# Altium project NANOPSU.PrjPcb
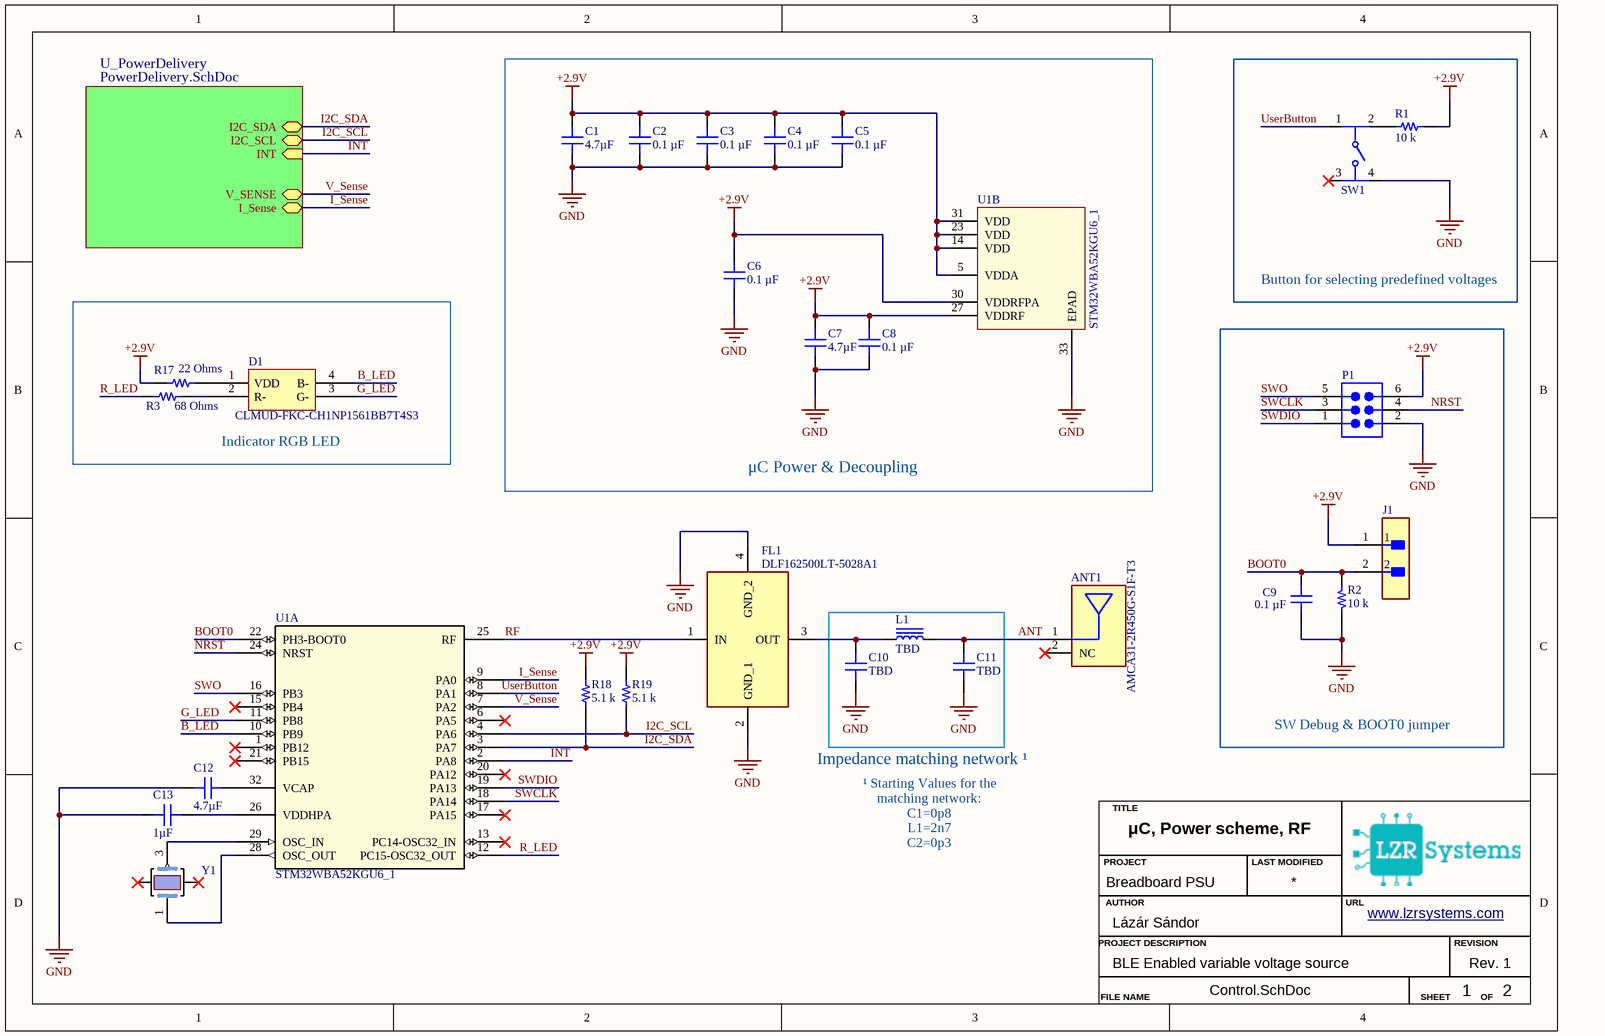
[diagram p0: Control.SchDoc]
G.Author: Lázár Sándor; G.Description: BLE Enabled variable voltage source; G.Project: Breadboard PSU; G.Revision: Rev. 1; G.Title: μC with Power Delivery; G.URL: www.lzrsystems.com
2 sheets, 60 parts. Net scope: hierarchical (ports join the sheet entries above them; power ports are global).
Board file: PCB1.PcbDoc
Sheets:
  Control.SchDoc
    U_PowerDelivery = PowerDelivery.SchDoc

## Sheet Control.SchDoc: μC, Power scheme, RF
size A4; SheetNumber: 1; SheetTotal: 2

### Parts
ANT1  AMCA31-2R450G-S1F-T3  [FP-AMCA31-MFG]
C1  4.7µF  [CAP 0805_2012]
C2  0.1 µF  [CAP 0805_2012]
C3  0.1 µF  [CAP 0805_2012]
C4  0.1 µF  [CAP 0805_2012]
C5  0.1 µF  [CAP 0805_2012]
C6  0.1 µF  [CAP 0805_2012]
C7  4.7µF  [CAP 0805_2012]
C8  0.1 µF  [CAP 0805_2012]
C9  0.1 µF  [CAP 0805_2012]
C10  Capacitance: TBD  [CAP 0402_1005]  (hidden comment: 3.6 pF)
C11  Capacitance: TBD  [CAP 0402_1005]  (hidden comment: 3.6 pF)
C12  4.7µF  [CAP 0805_2012]
C13  1µF  [CAP 0805_2012]
D1  CLMUD-FKC-CH1NP1561BB7T4S3  [SON70P150X100-4N]
FL1  DLF162500LT-5028A1  [DLF162500LT5028A1]
J1  TSW-102-12-T-S  [FP-TSW-102-12-T-S-MFG]  (value not drawn)
L1  TBD  [IND 0402_1005]
P1  MTLW-103-06-G-D-180  [SMTC-MTLW-103-06-X-D-180]  (value not drawn)
R1  10 k  [RES 0805_2012]
R2  10 k  [RES 0805_2012]
R3  68 Ohms  [YAGEO RES 0805_2012]
R17  22 Ohms  [RES 0805_2012]
R18  5.1 k  [YAGEO RES 0805_2012]
R19  5.1 k  [YAGEO RES 0805_2012]
SW1  TL1105AF160Q  [FP-TL1105AF160Q-MFG]  (value not drawn)
U1  STM32WBA52KGU6_1  [UFQFPN-32_STM]  (parts A,B of 2)
Y1  XRCGB32M000F2P01R0  [XRCGB]  (value not drawn)

### Blocks framed on the sheet
μC Power & Decoupling: C1-C8 U1
Button for selecting predefined voltages: R1 SW1
Indicator RGB LED: D1 R3 R17
SW Debug & BOOT0 jumper: C9 J1 P1 R2

### Sub-sheets
U_PowerDelivery = PowerDelivery.SchDoc: I2C_SDA (bidir), I2C_SCL (bidir), INT (in), I_Sense (bidir), V_SENSE (bidir)

### Nets
+2.9V: C1.2 C2.2 C3.2 C4.2 C5.2 C6.2 C7.2 C8.2 J1.1 P1.6 R1.2 R17.2 R18.2 R19.2 U1.5(VDDA) U1.14(VDD) U1.23(VDD) U1.27(VDDRF) U1.30(VDDRFPA) U1.31(VDD)
GND: C1.1 C2.1 C3.1 C4.1 C5.1 C6.1 C7.1 C8.1 C9.1 C10.1 C11.1 C12.1 C13.2 FL1.2(GND_1) FL1.4(GND_2) P1.2 R2.1 SW1.4 U1.33(EPAD)
ANT: ANT1.1(Feed_Point) C11.2 L1.2
B_LED: D1.4(B-) U1.10(PB9)
BOOT0: C9.2 J1.2 R2.2 U1.22(PH3-BOOT0)
G_LED: D1.3(G-) U1.11(PB8)
I2C_SCL: R19.1 U1.4(PA6) ; sheet U_PowerDelivery/I2C_SCL
I2C_SDA: R18.1 U1.3(PA7) ; sheet U_PowerDelivery/I2C_SDA
I_Sense: U1.9(PA0) ; sheet U_PowerDelivery/I_Sense
INT: U1.2(PA8) ; sheet U_PowerDelivery/INT
NRST: P1.4 U1.24(NRST)
R_LED: R3.1 U1.12(PC15-OSC32_OUT)
RF: FL1.1(IN) U1.25(RF)
SWCLK: P1.3 U1.18(PA14)
SWDIO: P1.1 U1.19(PA13)
SWO: P1.5 U1.16(PB3)
UserButton: SW1.1 U1.8(PA1)
V_Sense: U1.7(PA2) ; sheet U_PowerDelivery/V_SENSE
NetC10_2: C10.2 FL1.3(OUT) L1.1
NetC12_2: C12.2 U1.32(VCAP)
NetC13_1: C13.1 U1.26(VDDHPA)
NetD1_1: D1.1(VDD) R17.1
NetD1_2: D1.2(R-) R3.2
NetR1_1: R1.1 SW1.2
NetU1_28: U1.28(OSC_OUT) Y1.1(XTAL_1)
NetU1_29: U1.29(OSC_IN) Y1.3(XTAL_2)

Not connected (* = marked no-connect by the designer): ANT1 2(NC)*; SW1 3*; U1 1(PB12)* 6(PA5)* 13(PC14-OSC32_IN)* 15(PB4)* 17(PA15)* 20(PA12)* 21(PB15)*; Y1 2(NC_1)* 4*

### Notes on the sheet
- Impedance matching network ¹
- ¹ Starting Values for the matching network:
  C1=0p8
  L1=2n7
  C2=0p3
- TITLE
- AUTHOR
- PROJECT
- LAST MODIFIED
- URL
- PROJECT DESCRIPTION
- REVISION
- FILE NAME
- SHEET
- OF

### Library data of the parts
ANT1 = CMP-00025-00003-1: Chip Dielectric Antenna; 1dBi; 2450MHz; T/R; Frequency: 2.45GHz; Mounting Technology: Surface Mount; Max Operating Temperature: 85°C; Min Operating Temperature: -40°C; Case/Package: SMD/SMT
C1 C7 C12 = 0805ZD475KAT2A: CAP CER 4.7UF 10V X5R 0805; manufacturer: AVX Corporation; Tolerance: ±10%; Part Number: 0805ZD475KAT2A; Capacitance: 4.7µF; Applications: General Purpose; componentlink1description: Datasheet; componentlink1url: http://datasheets.avx.com/cx5r.pdf; componentlink2description: DigiKey Link; componentlink2url: http://digikey.com/product-detail/en/avx-corporation/0805ZD475KAT2A/478-1415-1-ND/564447; Device Package: 0805 (2012 Metric); lastupdated: 9/2/2020 1:04:40 AM; Lifecycle Status: Active; Minimum Order: 1; Mounting Type: Surface Mount, MLCC; Operating Temperature: -55°C ~ 85°C; Package / Case: 0805 (2012 Metric); packaging: TapeAndReel; partid: 3139; Part Status: Active; price: 0.12; series: -; Size / Dimension: 0.079" L x 0.049" W (2.01mm x 1.25mm); Supplier 1: DigiKey; Supplier Part Number 1: 478-1415-1-ND; Temperature Coefficient: X5R; Thickness (Max): 0.055" (1.40mm); value: 4.7µF; Voltage - Rated: 10V
C2-C6 C8 C9 = KGM21NR71H104MT: CAP CER 0.1UF 50V X7R 0805; manufacturer: KYOCERA AVX; Tolerance: ±20%; Part Number: KGM21NR71H104MT; Capacitance: 0.1 µF; Applications: General Purpose; componentlink1description: Datasheet; componentlink1url: https://datasheets.kyocera-avx.com/X7RDielectric.pdf; componentlink2description: DigiKey Link; componentlink2url: https://www.digikey.com/en/products/detail/kyocera-avx/KGM21NR71H104MT/929983; Device Package: 0805 (2012 Metric); lastupdated: 2/9/2024 8:14:06 PM; Lifecycle Status: Active; Minimum Order: 1; Mounting Type: Surface Mount, MLCC; Operating Temperature: -55°C ~ 125°C; Package / Case: 0805 (2012 Metric); packaging: TapeAndReel; partid: 53901; Part Status: Active; price: 0.01; series: KGM - X7R; Size / Dimension: 0.079" L x 0.049" W (2.01mm x 1.25mm); Supplier 1: DigiKey; Supplier Part Number 1: 478-KGM21NR71H104MTCT-ND; Temperature Coefficient: X7R; Thickness (Max): 0.039" (1.00mm); value: 0.1 µF; Voltage - Rated: 50V
C10 C11 = 600L3R6AT200T: CAP CER 3.6PF 200V C0G/NP0 0402; manufacturer: American Technical Ceramics; Temperature Coefficient: C0G, NP0; Tolerance: ±0.05pF; Part Number: 600L3R6AT200T; Applications: RF, Microwave, High Frequency, Bypass, Decoupling; componentlink1description: Datasheet; componentlink1url: http://www.atceramics.com/UserFiles/600l.pdf; componentlink2description: DigiKey Link; componentlink2url: https://www.digikey.com/en/products/detail/american-technical-ceramics/600L3R6AT200T/3905167; Device Package: 0402 (1005 Metric); Features: High Q, Low Loss, Ultra Low ESR; lastupdated: 2/9/2024 8:04:37 PM; Lifecycle Status: Active; Minimum Order: 1; Mounting Type: Surface Mount, MLCC; Operating Temperature: -55°C ~ 125°C; Package / Case: 0402 (1005 Metric); packaging: TapeAndReel; partid: 2064; Part Status: Active; price: 0.49; series: ATC 600L; Size / Dimension: 0.040" L x 0.020" W (1.02mm x 0.51mm); Supplier 1: DigiKey; Supplier Part Number 1: 1284-1126-1-ND; Thickness (Max): 0.024" (0.60mm); value: 3.6 pF; Voltage - Rated: 200V
C13 = 08053C105KAT2A: CAP CER 1UF 25V X7R 0805; manufacturer: AVX Corporation; Tolerance: ±10%; Part Number: 08053C105KAT2A; Capacitance: 1µF; Applications: General Purpose; componentlink1description: Datasheet; componentlink1url: http://datasheets.avx.com/X7RDielectric.pdf; componentlink2description: DigiKey Link; componentlink2url: http://digikey.com/product-detail/en/avx-corporation/08053C105KAT2A/478-5030-1-ND/1888241; Device Package: 0805 (2012 Metric); lastupdated: 9/2/2020 1:04:33 AM; Lifecycle Status: Active; Minimum Order: 1; Mounting Type: Surface Mount, MLCC; Operating Temperature: -55°C ~ 125°C; Package / Case: 0805 (2012 Metric); packaging: TapeAndReel; partid: 7289; Part Status: Active; price: 0.04; series: -; Size / Dimension: 0.079" L x 0.049" W (2.01mm x 1.25mm); Supplier 1: DigiKey; Supplier Part Number 1: 478-5030-1-ND; Temperature Coefficient: X7R; Thickness (Max): 0.037" (0.94mm); value: 1µF; Voltage - Rated: 25V
D1 = CMP-007-00044-3: Cree LED RGB LED Common Annode If=10mA Vf = 1.9/2.6/2.7
FL1 = DLF162500LT-5028A1: Filter; Manufacturer_Name: TDK; Datasheet Link: https://product.tdk.com/system/files/dam/doc/product/rf/rf/filter/catalog/rf_lpf_dlf162500lt-5028a1_en.pdf; Height: 0.4mm; Manufacturer_Part_Number: DLF162500LT-5028A1; Mouser Part Number: 810-DLF16250LT5028A1; Mouser Price/Stock: https://www.mouser.co.uk/ProductDetail/TDK/DLF162500LT-5028A1?qs=U%2FZX79kHR%2FlwIbAISCs3qA%3D%3D; Arrow Part Number: DLF162500LT-5028A1; Arrow Price/Stock: https://www.arrow.com/en/products/dlf162500lt-5028a1/tdk?utm_currency=USD&region=nac
J1 = CMP-002-00077-1: Pin Header, Board-to-Board, 2.54 mm, 1 Rows, 2 Contacts, Through Hole, TSW Series; Voltage Rating: 550V; Gender: Male; Min Operating Temperature: -55°C; Max Operating Temperature: 105°C; Mounting Technology: Through Hole
L1 = LQG15HS3N9C02D: FIXED IND 3.9NH 750MA 140MOHM SM; Manufacturer: Murata Electronics; DC Resistance (DCR): 140mOhm Max; Frequency - Self Resonant: 6GHz; Inductance Frequency - Test: 100 MHz; Material - Core: Air; Shielding: Unshielded; Tolerance: ±0.2nH; Type: Multilayer; Part Number: LQG15HS3N9C02D; ComponentLink1Description: Datasheet; ComponentLink1URL: https://search.murata.co.jp/Ceramy/image/img/P02/JELF243B-0010.pdf; ComponentLink2Description: DigiKey Link; ComponentLink2URL: https://www.digikey.com/en/products/detail/murata-electronics/LQG15HS3N9C02D/6798548; Current Rating (Amps): 750 mA; Device Package: 0402 (1005 Metric); Height - Seated (Max): 0.022" (0.55mm); Inductance: 3.9 nH; LastUpdated: 6/3/2024 8:13:02 PM; Lifecycle Status: Active; Minimum Order: 1; Mounting Type: Surface Mount; Operating Temperature: -55°C ~ 125°C; Package / Case: 0402 (1005 Metric); Packaging: TapeAndReel; PartId: 2221; Part Status: Active; Price: 0.02; Series: LQG15; Size / Dimension: 0.039" L x 0.020" W (1.00mm x 0.50mm); Supplier 1: DigiKey; Supplier Part Number 1: 490-15123-1-ND; Supplier Device Package: 0402 (1005 Metric); Value: 3.9 nH
P1 = CMP-002-00079-1: Pin Header, Board-to-Board, 2.54 mm, 2 Rows, 6 Contacts, Through Hole, MTLW Series; Max Operating Temperature: 125°C; Min Operating Temperature: -55°C
R1 R2 = RNCS0805BKE10K0: RES 10K OHM 0.1% 1/10W 0805; Manufacturer: Stackpole Electronics Inc; Power (Watts): 0.1W, 1/10W; Resistance: 10 kOhms; Temperature Coefficient: ±25ppm/°C; Part Number: RNCS0805BKE10K0; Value: 10 k; ComponentLink1Description: Datasheet; ComponentLink1URL: https://www.seielect.com/catalog/sei-rncs_rnch.pdf; ComponentLink2Description: DigiKey Link; ComponentLink2URL: https://www.digikey.com/en/products/detail/stackpole-electronics-inc/RNCS0805BKE10K0/1800067; Composition: Thin Film; Device Package: 0805 (2012 Metric); Features: Anti-Corrosive, Automotive AEC-Q200, Moisture Resistant; Height - Seated (Max): 0.026" (0.65mm); LastUpdated: 2/8/2024 9:02:39 PM; Lifecycle Status: Active; Minimum Order: 1; Number of Terminations: 2; Operating Temperature: -55°C ~ 155°C; Package / Case: 0805 (2012 Metric); Packaging: TapeAndReel; PartId: 27713; Part Status: Active; Price: 0.07; Ratings: AEC-Q200; Series: RNCS; Size / Dimension: 0.079" L x 0.049" W (2.00mm x 1.25mm); Supplier 1: DigiKey; Supplier Part Number 1: RNCS0805BKE10K0CT-ND; Supplier Device Package: 0805; Tolerance: ±0.1%
R3 = RC0805FR-0768R1L: RES 68.1 OHM 1% 1/8W 0805; Manufacturer: Yageo; Power (Watts): 0.125W, 1/8W; Resistance: 68.1 Ohms; Temperature Coefficient: ±100ppm/°C; Part Number: RC0805FR-0768R1L; Value: 68 Ohms; ComponentLink1Description: Datasheet; ComponentLink1URL: https://www.yageo.com/upload/media/product/productsearch/datasheet/rchip/PYu-RC_Group_51_RoHS_L_10.pdf; ComponentLink2Description: DigiKey Link; ComponentLink2URL: https://www.digikey.com/en/products/detail/yageo/RC0805FR-0768R1L/728099; Composition: Thick Film; Device Package: 0805 (2012 Metric); Features: Moisture Resistant; Height - Seated (Max): 0.024" (0.60mm); LastUpdated: 7/25/2024 9:20:18 AM; Lifecycle Status: Active; Minimum Order: 1; Number of Terminations: 2; Operating Temperature: -55°C ~ 155°C; Package / Case: 0805 (2012 Metric); Packaging: TapeAndReel; PartId: 44821; Part Status: Active; Price: 0.01; Series: RC_L; Size / Dimension: 0.079" L x 0.049" W (2.00mm x 1.25mm); Supplier 1: DigiKey; Supplier Part Number 1: 311-68.1CRCT-ND; Supplier Device Package: 0805; Tolerance: ±1%
R17 = SFR10EZPJ220: RES 22 OHM 5% 1/8W 0805; Manufacturer: Rohm Semiconductor; Power (Watts): 0.125W, 1/8W; Temperature Coefficient: ±200ppm/°C; Part Number: SFR10EZPJ220; Value: 22 Ohms; ComponentLink1Description: Datasheet; ComponentLink1URL: https://fscdn.rohm.com/en/products/databook/datasheet/passive/resistor/chip_resistor/sfr-e.pdf; ComponentLink2Description: DigiKey Link; ComponentLink2URL: https://www.digikey.com/en/products/detail/rohm-semiconductor/SFR10EZPJ220/17944490; Composition: Thick Film; Device Package: 0805 (2012 Metric); Features: Anti-Sulfur, Automotive AEC-Q200; Height - Seated (Max): 0.026" (0.65mm); LastUpdated: 2/8/2024 9:00:13 PM; Lifecycle Status: Active; Minimum Order: 1; Number of Terminations: 2; Operating Temperature: -55°C ~ 155°C; Package / Case: 0805 (2012 Metric); Packaging: TapeAndReel; PartId: 73570; Part Status: Active; Price: 0.01; Ratings: AEC-Q200; Resistance: 22 Ohms; Series: SFR; Size / Dimension: 0.079" L x 0.049" W (2.00mm x 1.25mm); Supplier 1: DigiKey; Supplier Part Number 1: 511-SFR10EZPJ220CT-ND; Supplier Device Package: 0805; Tolerance: ±5%
R18 R19 = RT0805BRD075K1L: RES SMD 5.1K OHM 0.1% 1/8W 0805; Manufacturer: Yageo; Power (Watts): 0.125W, 1/8W; Resistance: 5.1 kOhms; Temperature Coefficient: ±25ppm/°C; Part Number: RT0805BRD075K1L; Value: 5.1 k; ComponentLink1Description: Datasheet; ComponentLink1URL: https://www.yageo.com/upload/media/product/productsearch/datasheet/rchip/PYu-RT_1-to-0.01_RoHS_L_11.pdf; ComponentLink2Description: DigiKey Link; ComponentLink2URL: https://www.digikey.com/en/products/detail/yageo/RT0805BRD075K1L/1075977; Composition: Thin Film; Device Package: 0805 (2012 Metric); Height - Seated (Max): 0.024" (0.60mm); LastUpdated: 7/25/2024 9:20:25 AM; Lifecycle Status: Active; Minimum Order: 1; Number of Terminations: 2; Operating Temperature: -55°C ~ 155°C; Package / Case: 0805 (2012 Metric); Packaging: TapeAndReel; PartId: 32968; Part Status: Active; Price: 0.04; Series: RT; Size / Dimension: 0.079" L x 0.049" W (2.00mm x 1.25mm); Supplier 1: DigiKey; Supplier Part Number 1: YAG1938CT-ND; Supplier Device Package: 0805; Tolerance: ±0.1%
SW1 = CMP-011-00014-1: Switch Tactile N.O. SPST Round Button PC Pins 0.05A 50VDC 1.57N Thru-Hole; Current Rating: 50mA; Throw Configuration: SPST; Mounting Technology: Through Hole; Min Operating Temperature: -20°C; Max Current Rating: 50mA; Max Operating Temperature: 70°C
U1 = CMP-031-00007-6: Ultra-low-power, Arm Cortex-M33 Trust Zone MCU 100 MHz with 1 Mbyte of Flash memory,  Bluetooth LE 5.4; Manufacturer_Name: STMicroelectronics; Type: Type; Source: STM32WBA52KGU6.SchLib; Design Item ID: STM32WBA52KGU6_1; Manufacturer_Part_Number: STM32WBA52KGU6; Datasheet: https://www.st.com/resource/en/datasheet/stm32wba52ce.pdf; RefDes: RefDes; Copyright: Copyright (C) 2025 Ultra Librarian. All rights reserved.; Component Type: Standard; Pins: 33
Y1 = XRCGB32M000F2P01R0: Crystal or Oscillator; Manufacturer_Name: Murata Electronics; Datasheet Link: https://www.murata.com/products/productdata/8801065500702/SPEC-XRCGB32M000F2P01R0.pdf; Height: 0.7mm; Manufacturer_Part_Number: XRCGB32M000F2P01R0; Mouser Part Number: 81-XRCGB32M000F2P01R; Mouser Price/Stock: https://www.mouser.co.uk/ProductDetail/Murata-Electronics/XRCGB32M000F2P01R0?qs=rrS6PyfT74czmgr%252Bqfmsyw%3D%3D; Arrow Part Number: XRCGB32M000F2P01R0; Arrow Price/Stock: https://www.arrow.com/en/products/xrcgb32m000f2p01r0/murata-manufacturing?region=nac

## Sheet PowerDelivery.SchDoc: PPS, 2.9V rail, U/I sensing
size A4; SheetNumber: 2; SheetTotal: 2
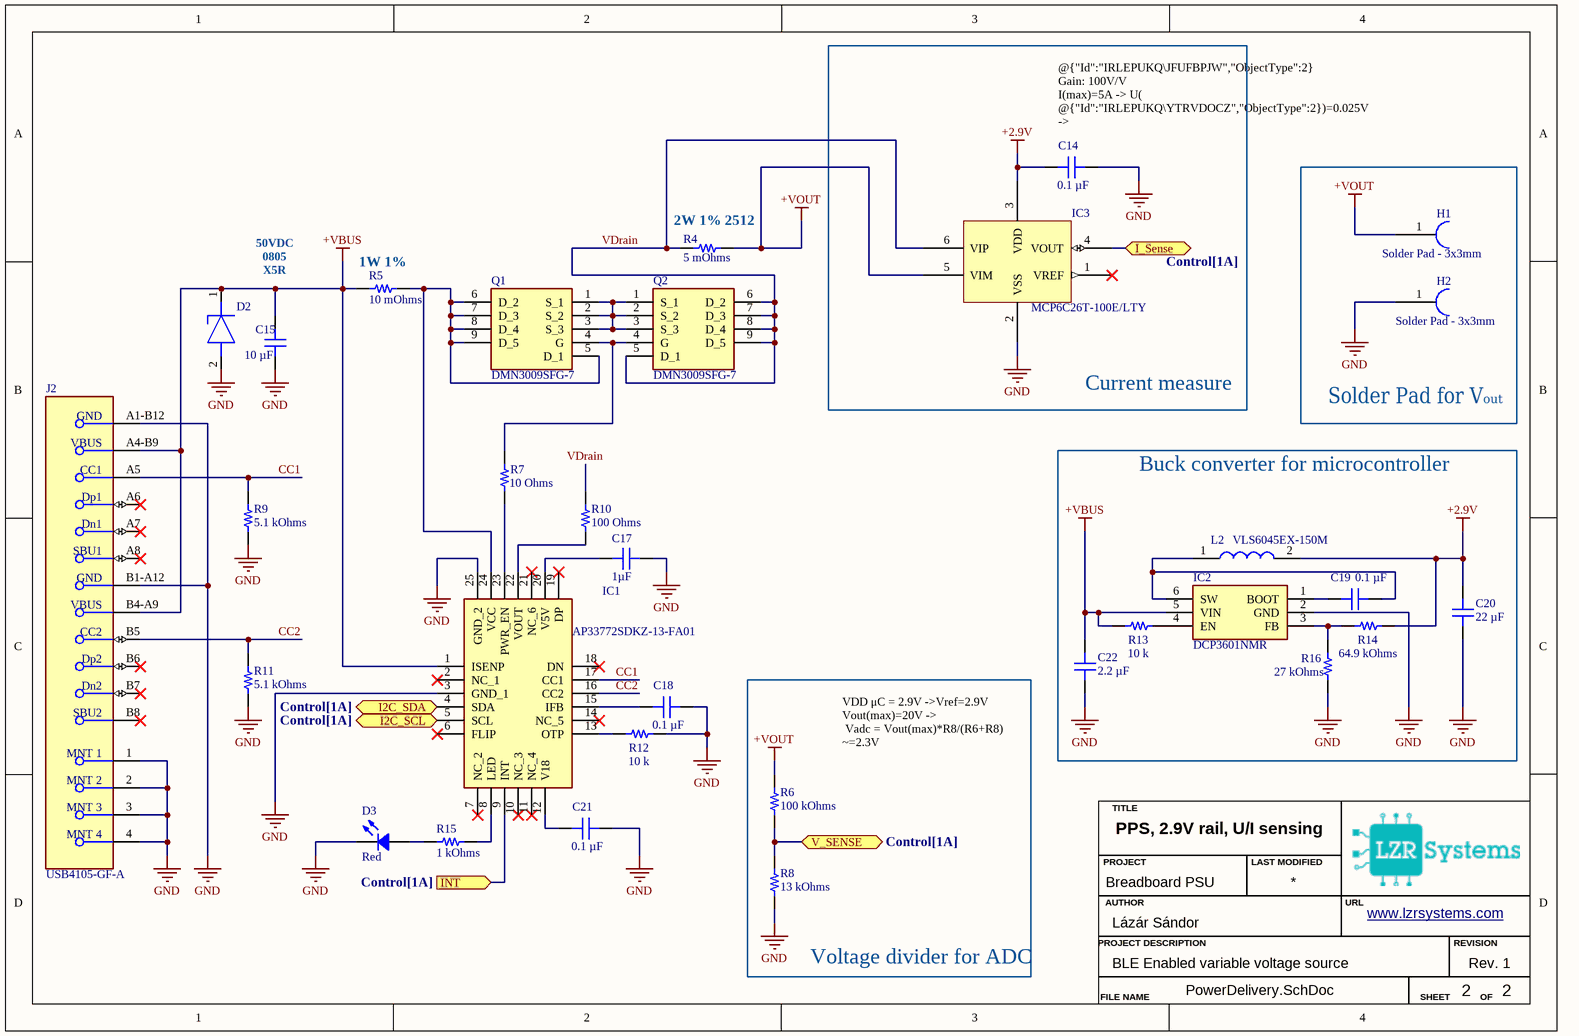
[diagram p1: PowerDelivery.SchDoc]

### Parts
C14  0.1 µF  [CAP 0805_2012]
C15  10 µF  [MURATA GRM21B 0805_2012]
C17  1µF  [CAP 0805_2012]
C18  0.1 µF  [CAP 0805_2012]
C19  0.1 µF  [CAP 0805_2012]
C20  22 µF  [CAP 1206_3216 - 0.8MM]
C21  0.1 µF  [CAP 0805_2012]
C22  2.2 µF  [CAP 1206_3216 - 0.8MM]
D2  PESD24VS1UA,115  [SOD2512X110N]  (value not drawn)
D3  Red  [LED 1206_3216 RED]
H1  Solder Pad - 3x3mm  [Solder Pad - 3x3mm-Footprint-1]
H2  Solder Pad - 3x3mm  [Solder Pad - 3x3mm-Footprint-1]
IC1  AP33772SDKZ-13-FA01  [AP33772SDKZ13FA01]
IC2  DCP3601NMR  [SOT95P280X125-6N]
IC3  MCP6C26T-100E/LTY  [SOT65P210X80-6N]
J2  USB4105-GF-A  [FP-USB4105-GF-A-MFG]
L2  VLS6045EX-150M  [VLS6045]
Q1  DMN3009SFG-7  [DMTH8008LFGQ7]
Q2  DMN3009SFG-7  [DMTH8008LFGQ7]
R4  5 mOhms  [STACKPOLE CSM2512]
R5  10 mOhms  [RES 1206_3216]
R6  100 kOhms  [RES 0805_2012]
R7  10 Ohms  [RES 0805_2012]
R8  13 kOhms  [RES 0805_2012]
R9  5.1 kOhms  [YAGEO RES 0805_2012]
R10  100 Ohms  [RES 0805_2012]
R11  5.1 kOhms  [YAGEO RES 0805_2012]
R12  10 k  [RES 0805_2012]
R13  10 k  [RES 0805_2012]
R14  64.9 kOhms  [RES 0805_2012]
R15  1 kOhms  [RES 0805_2012]
R16  27 kOhms  [YAGEO RES 0805_2012]

### Blocks framed on the sheet
Current measure: C14 IC3
Solder Pad for Vₒᵤₜ: H1 H2
Buck converter for microcontroller: C19 C20 C22 IC2 L2 R13 R14 R16
Voltage divider for ADC: R6 R8

### Ports
I2C_SCL (bidir, see Control[1A]), I2C_SDA (bidir, see Control[1A]), I_Sense (bidir, see Control[1A]), INT (in, see Control[1A]), V_SENSE (bidir, see Control[1A])

### Nets
+2.9V: C14.2 C20.2 IC3.3(VDD) L2.2 R14.2
+VBUS: C15.2 C22.2 D2.1(K) IC1.1(ISENP) IC2.5(VIN) J2.A4-B9(VBUS) J2.B4-A9(VBUS) R5.1 R13.1
+VOUT: H1.1 IC3.5(VIM) R4.2 R6.2
GND: C14.1 C15.1 C17.2 C18.1 C20.1 C21.1 C22.1 D2.2(A) D3.2 H2.1 IC1.3(GND_1) IC1.25(GND_2) IC2.2(GND) IC3.2(VSS) J2.1(MNT_1) J2.2(MNT_2) J2.3(MNT_3) J2.4(MNT_4) J2.A1-B12(GND) J2.B1-A12(GND) R8.1 R9.1 R11.1 R12.2 R16.1
CC1: IC1.17(CC1) J2.A5(CC1) R9.2
CC2: IC1.16(CC2) J2.B5(CC2) R11.2
I2C_SCL: IC1.5(SCL) ; port I2C_SCL
I2C_SDA: IC1.4(SDA) ; port I2C_SDA
I_Sense: IC3.4(VOUT) ; port I_Sense
INT: IC1.9(INT) ; port INT
V_Sense: R6.1 R8.2 ; port V_SENSE
VDrain: IC3.6(VIP) Q2.5(D_1) Q2.6(D_2) Q2.7(D_3) Q2.8(D_4) Q2.9(D_5) R4.1 R10.2
NetC17_1: C17.1 IC1.20(V5V)
NetC18_2: C18.2 IC1.15(IFB)
NetC19_1: C19.1 IC2.1(BOOT)
NetC19_2: C19.2 IC2.6(SW) L2.1
NetC21_2: C21.2 IC1.12(V18)
NetD3_1: D3.1 R15.1
NetIC1_8: IC1.8(LED) R15.2
NetIC1_13: IC1.13(OTP) R12.1
NetIC1_22: IC1.22(VOUT) R10.1
NetIC1_23: IC1.23(PWR_EN) R7.1
NetIC1_24: IC1.24(VCC) Q1.5(D_1) Q1.6(D_2) Q1.7(D_3) Q1.8(D_4) Q1.9(D_5) R5.2
NetIC2_3: IC2.3(FB) R14.1 R16.2
NetIC2_4: IC2.4(EN) R13.2
NetQ1_1: Q1.1(S_1) Q1.2(S_2) Q1.3(S_3) Q2.1(S_1) Q2.2(S_2) Q2.3(S_3)
NetQ1_4: Q1.4(G) Q2.4(G) R7.2

Not connected (* = marked no-connect by the designer): IC1 2(NC_1)* 6(FLIP)* 7(NC_2)* 10(NC_3)* 11(NC_4)* 14(NC_5)* 18(DN)* 19(DP)* 21(NC_6)*; IC3 1(VREF)*; J2 A6(Dp1)* A7(Dn1)* A8(SBU1)* B6(Dp2)* B7(Dn2)* B8(SBU2)*

### Notes on the sheet
- (near C14) @{"Id":"IRLEPUKQ\JFUFBPJW","ObjectType":2} Gain: 100V/V
  I(max)=5A -> U( @{"Id":"IRLEPUKQ\YTRVDOCZ","ObjectType":2})=0.025V ->
  Uadc(max) = 2.5V
- Type @ to refer to a designator
- (near R4) 2W 1% 2512
- 50VDC
  0805
  X5R
- (near R5) 1W 1%
- VDD μC = 2.9V ->Vref=2.9V
  Vout(max)=20V ->
  Vadc = Vout(max)*R8/(R6+R8) ~=2.3V
- TITLE
- AUTHOR
- PROJECT
- LAST MODIFIED
- URL
- PROJECT DESCRIPTION
- REVISION
- FILE NAME
- SHEET
- OF

### Library data of the parts
C14 C18 C19 C21 = CC0805MRX7R9BB104: CAP CER 0.1UF 50V X7R 0805; manufacturer: Yageo; Tolerance: ±20%; Part Number: CC0805MRX7R9BB104; Capacitance: 0.1 µF; Applications: General Purpose; componentlink1description: Datasheet; componentlink1url: https://www.yageo.com/upload/media/product/productsearch/datasheet/mlcc/UPY-GPHC_X7R_6.3V-to-50V_18.pdf; componentlink2description: DigiKey Link; componentlink2url: https://www.digikey.com/en/products/detail/yageo/CC0805MRX7R9BB104/5884281; Device Package: 0805 (2012 Metric); lastupdated: 2/9/2024 8:16:09 PM; Lifecycle Status: Active; Minimum Order: 1; Mounting Type: Surface Mount, MLCC; Operating Temperature: -55°C ~ 125°C; Package / Case: 0805 (2012 Metric); packaging: TapeAndReel; partid: 2475; Part Status: Active; price: 0.01; series: CC; Size / Dimension: 0.079" L x 0.049" W (2.00mm x 1.25mm); Supplier 1: DigiKey; Supplier Part Number 1: 311-4351-1-ND; Temperature Coefficient: X7R; Thickness (Max): 0.037" (0.95mm); value: 0.1 µF; Voltage - Rated: 50V
C15 = GRM21BR61H106KE43L: CAP CER 10UF 50V X5R 0805; manufacturer: Murata Electronics; Tolerance: ±10%; Part Number: GRM21BR61H106KE43L; Capacitance: 10 µF; Applications: Mobile Devices Only; componentlink1description: Datasheet; componentlink1url: https://search.murata.co.jp/Ceramy/image/img/A01X/G101/ENG/GRM21BR61H106KE43-01A.pdf; componentlink2description: DigiKey Link; componentlink2url: https://www.digikey.com/en/products/detail/murata-electronics/GRM21BR61H106KE43L/10326316; Device Package: 0805 (2012 Metric); lastupdated: 8/27/2024 9:29:56 AM; Lifecycle Status: Active; Minimum Order: 1; Mounting Type: Surface Mount, MLCC; Operating Temperature: -55°C ~ 85°C; Package / Case: 0805 (2012 Metric); packaging: TapeAndReel; partid: 39284; Part Status: Active; price: 0.05; series: GRM; Size / Dimension: 0.079" L x 0.049" W (2.00mm x 1.25mm); Supplier 1: DigiKey; Supplier Part Number 1: 490-18663-1-ND; Temperature Coefficient: X5R; Thickness (Max): 0.057" (1.45mm); value: 10 µF; Voltage - Rated: 50V
C17 = 08053C105KAT2A: as C13 on sheet Control; Part Number: 08053C105KAT2A; Capacitance: 1µF; Applications: General Purpose; componentlink1description: Datasheet; componentlink1url: http://datasheets.avx.com/X7RDielectric.pdf; componentlink2description: DigiKey Link; componentlink2url: http://digikey.com/product-detail/en/avx-corporation/08053C105KAT2A/478-5030-1-ND/1888241; Device Package: 0805 (2012 Metric); lastupdated: 9/2/2020 1:04:33 AM; Lifecycle Status: Active; Minimum Order: 1; Mounting Type: Surface Mount, MLCC; Operating Temperature: -55°C ~ 125°C; Package / Case: 0805 (2012 Metric); packaging: TapeAndReel; partid: 7289; Part Status: Active; price: 0.04; series: -; Size / Dimension: 0.079" L x 0.049" W (2.01mm x 1.25mm); Supplier 1: DigiKey; Supplier Part Number 1: 478-5030-1-ND; Temperature Coefficient: X7R; Thickness (Max): 0.037" (0.94mm); value: 1µF; Voltage - Rated: 25V
C20 = CL31A226MOCLNNC: CAP CER 22UF 16V X5R 1206; manufacturer: Samsung Electro-Mechanics; Tolerance: ±20%; Part Number: CL31A226MOCLNNC; Capacitance: 22 µF; Applications: General Purpose; componentlink1description: Datasheet; componentlink1url: http://www.samsungsem.com/kr/support/product-search/mlcc/CL31A226MOCLNNC.jsp; componentlink2description: DigiKey Link; componentlink2url: https://www.digikey.com/en/products/detail/samsung-electro-mechanics/CL31A226MOCLNNC/3888386; Device Package: 1206 (3216 Metric); Features: Low Profile; lastupdated: 6/4/2024 7:10:40 PM; Lifecycle Status: Active; Minimum Order: 1; Mounting Type: Surface Mount, MLCC; Operating Temperature: -55°C ~ 85°C; Package / Case: 1206 (3216 Metric); packaging: TapeAndReel; partid: 19106; Part Status: Active; price: 0.04; series: CL; Size / Dimension: 0.126" L x 0.063" W (3.20mm x 1.60mm); Supplier 1: DigiKey; Supplier Part Number 1: 1276-2728-1-ND; Temperature Coefficient: X5R; Thickness (Max): 0.037" (0.95mm); value: 22 µF; Voltage - Rated: 16V
C22 = GCJ31CR71H225KA12K: CAP CER 2.2UF 50V X7R 1206; manufacturer: Murata Electronics; Tolerance: ±10%; Part Number: GCJ31CR71H225KA12K; Capacitance: 2.2 µF; Applications: Automotive, Boardflex Sensitive; componentlink1description: Datasheet; componentlink1url: https://search.murata.co.jp/Ceramy/image/img/A01X/G101/ENG/GCJ31CR71H225KA12-01.pdf; componentlink2description: DigiKey Link; componentlink2url: https://www.digikey.com/en/products/detail/murata-electronics/GCJ31CR71H225KA12K/11618649; Device Package: 1206 (3216 Metric); Features: Soft Termination; lastupdated: 6/4/2024 7:10:16 PM; Lifecycle Status: Active; Minimum Order: 1; Mounting Type: Surface Mount, MLCC; Operating Temperature: -55°C ~ 125°C; Package / Case: 1206 (3216 Metric); packaging: TapeAndReel; partid: 30270; Part Status: Active; price: 0.06; Ratings: AEC-Q200; series: GCJ; Size / Dimension: 0.126" L x 0.063" W (3.20mm x 1.60mm); Supplier 1: DigiKey; Supplier Part Number 1: 490-GCJ31CR71H225KA12KCT-ND; Temperature Coefficient: X7R; Thickness (Max): 0.075" (1.90mm); value: 2.2 µF; Voltage - Rated: 50V
D2 = PESD24VS1UA,115: Diode ESD (Uni-directional); Manufacturer_Name: Nexperia; Datasheet Link: https://assets.nexperia.com/documents/data-sheet/PESD24VS1UA.pdf; Height: 1.1mm; Manufacturer_Part_Number: PESD24VS1UA,115; Mouser Part Number: 771-PESD24VS1UA115; Mouser Price/Stock: https://www.mouser.co.uk/ProductDetail/Nexperia/PESD24VS1UA115?qs=A1cBxND5mHKZ%252BhkKKiwSEA%3D%3D; Arrow Part Number: PESD24VS1UA,115; Arrow Price/Stock: https://www.arrow.com/en/products/pesd24vs1ua115/nexperia
D3 = 5990210007F: LED RED 1206 SMD; Manufacturer: Dialight; Configuration: Standard; Current - Test: 20mA; Lens Color: 0.80mm; Lens Size: 2.00mm x 1.60mm; Lens Style: Rectangle with Flat Top; Millicandela Rating: 29mcd; Viewing Angle: 140°; Voltage - Forward (Vf) (Typ): 2.1V; Wavelength - Dominant: 633nm; Part Number: 5990210007F; Color: Red; ComponentLink1Description: Datasheet; ComponentLink1URL: http://www.dialightsignalsandcomponents.com/Assets/Brochures_And_Catalogs/Indication/CBI_SMD_new/Dialight_CBI_data_599-1206_Apr2018.pdf; ComponentLink2Description: DigiKey Link; ComponentLink2URL: https://www.digikey.com/en/products/detail/dialight/5990210007F/9385415; Device Package: 1206 (3216 Metric); Height (Max): 0.80mm; LastUpdated: 6/3/2024 8:00:41 PM; Lifecycle Status: Active; Minimum Order: 1; Mounting Type: Surface Mount; Package / Case: 1206 (3216 Metric); Packaging: TapeAndReel; PartId: 188; Part Status: Active; Price: 0.04; Series: 599; Size / Dimension: 3.20mm L x 1.60mm W; Supplier 1: DigiKey; Supplier Part Number 1: 350-4360-1-ND; Supplier Device Package: 1206; Value: Red
H1 H2 = CMP-002-00073-4: Wire to board solder pad rectangular 3x3mm
IC1 = AP33772SDKZ-13-FA01: Integrated Circuit; Manufacturer_Name: Diodes Incorporated; Datasheet Link: https://www.diodes.com/datasheet/download/AP33772S.pdf; Height: 0.8mm; Manufacturer_Part_Number: AP33772SDKZ-13-FA01; Mouser Part Number: 621-P33772SDKZ13FA01; Mouser Price/Stock: https://www.mouser.co.uk/ProductDetail/Diodes-Incorporated/AP33772SDKZ-13-FA01?qs=2wMNvWM5ZX4CLYQ4%252BLyimw%3D%3D
IC2 = DCP3601NMR: Integrated Circuit; Manufacturer_Name: STMicroelectronics; Datasheet Link: https://www.st.com/resource/en/datasheet/dcp3601.pdf; Height: 1.25mm; Manufacturer_Part_Number: DCP3601NMR; Mouser Part Number: 511-DCP3601NMR; Mouser Price/Stock: https://www.mouser.co.uk/ProductDetail/STMicroelectronics/DCP3601NMR?qs=VVKQmw408U%252BduQkqjRfAvg%3D%3D
IC3 = CMP-014-00006-1: Current Sense Amplifiers Zero-Drift, Current Sense Amplifier, Gain = 100V/V, REEL; Pins: 6
J2 = CMP-002-00071-1: Conn USB 2.0 Type C RCP 24 POS 0.3mm/0.5mm Solder RA SMD 24 Terminal 1 Port T/R
L2 = VLS6045EX-150M: Inductor; Manufacturer_Name: TDK; Datasheet Link: https://product.tdk.com/system/files/dam/doc/product/inductor/inductor/smd/catalog/inductor_commercial_power_vls6045ex_en.pdf; Manufacturer_Part_Number: VLS6045EX-150M; Mouser Part Number: 810-VLS6045EX-150M; Mouser Price/Stock: https://www.mouser.co.uk/ProductDetail/TDK/VLS6045EX-150M?qs=oF%2FSscNnLpDh4m%2FVdQ%2FgKQ%3D%3D; Arrow Part Number: VLS6045EX-150M; Arrow Price/Stock: https://www.arrow.com/en/products/vls6045ex-150m/tdk?region=nac
Q1 Q2 = DMN3009SFG-7: MOSFET (N-Channel); Manufacturer_Name: Diodes Incorporated; Datasheet Link: https://www.diodes.com/datasheet/download/DMN3009SFG.pdf; Height: 0.8mm; Manufacturer_Part_Number: DMN3009SFG-7; Mouser Part Number: 621-DMN3009SFG-7; Mouser Price/Stock: https://www.mouser.co.uk/ProductDetail/Diodes-Incorporated/DMN3009SFG-7?qs=NnBbvHfz1MnfgYcTpHZiGg%3D%3D
R4 = CSM2512FT40L0: RES 0.04 OHM 1% 3W 2512; manufacturer: Stackpole Electronics Inc; Resistance: 40 mOhms; Temperature Coefficient: ±50ppm/°C; value: 40 mOhms; Part Number: CSM2512FT40L0; componentlink1description: Datasheet; componentlink1url: https://www.seielect.com/Catalog/SEI-CSM.PDF; componentlink2description: DigiKey Link; componentlink2url: https://www.digikey.com/en/products/detail/stackpole-electronics-inc/CSM2512FT40L0/13930213; Composition: Metal Element; Device Package: 2512 (6332 Metric); Features: Automotive AEC-Q200, Current Sense; Height - Seated (Max): 0.043" (1.10mm); lastupdated: 6/3/2024 8:27:03 PM; Lifecycle Status: Active; Minimum Order: 1; Number of Terminations: 2; Operating Temperature: -55°C ~ 170°C; Package / Case: 2512 (6332 Metric); packaging: TapeAndReel; Part Status: Active; Power (Watts): 3W; price: 0.19; Ratings: AEC-Q200; series: CSM; Size / Dimension: 0.252" L x 0.126" W (6.40mm x 3.20mm); Supplier 1: DigiKey; Supplier Part Number 1: 738-CSM2512FT40L0CT-ND; Supplier Device Package: 2512; Tolerance: ±1%
R5 = TLRP2B10WR010FTD: RES 0.01 OHM 1% 1W 1206; Manufacturer: TE Connectivity Passive Product; Temperature Coefficient: ±75ppm/°C; Part Number: TLRP2B10WR010FTD; ComponentLink1Description: Datasheet; ComponentLink1URL: https://www.te.com/commerce/DocumentDelivery/DDEController?Action=srchrtrv&DocNm=1773449-4&DocType=DS&DocLang=English; ComponentLink2Description: DigiKey Link; ComponentLink2URL: https://www.digikey.com/en/products/detail/te-connectivity-passive-product/TLRP2B10WR010FTD/14652424; Composition: Metal Element; Device Package: 1206 (3216 Metric); Features: Anti-Sulfur, Automotive AEC-Q200, Current Sense; Height - Seated (Max): 0.026" (0.65mm); LastUpdated: 2/9/2024 8:53:14 PM; Lifecycle Status: Active; Minimum Order: 1; Number of Terminations: 2; Operating Temperature: -55°C ~ 170°C; Package / Case: 1206 (3216 Metric); Packaging: TapeAndReel; PartId: 67637; Part Status: Active; Power (Watts): 1W; Price: 0.13; Ratings: AEC-Q200; Resistance: 10 mOhms; Series: TLRP; Size / Dimension: 0.124" L x 0.057" W (3.15mm x 1.45mm); Supplier 1: DigiKey; Supplier Part Number 1: 1712-TLRP2B10WR010FTDCT-ND; Supplier Device Package: 1206; Tolerance: ±1%; Value: 10 mOhms
R6 = CRCW0805100KFKEA: RES SMD 100K OHM 1% 1/8W 0805; Manufacturer: Vishay Dale; Power (Watts): 0.125W, 1/8W; Temperature Coefficient: ±100ppm/°C; Part Number: CRCW0805100KFKEA; Value: 100 kOhms; ComponentLink1Description: Datasheet; ComponentLink1URL: http://www.vishay.com/docs/20035/dcrcwe3.pdf; ComponentLink2Description: DigiKey Link; ComponentLink2URL: https://www.digikey.com/en/products/detail/vishay-dale/CRCW0805100KFKEA/1175865; Composition: Thick Film; Device Package: 0805 (2012 Metric); Features: Automotive AEC-Q200; Height - Seated (Max): 0.020" (0.50mm); LastUpdated: 2/8/2024 9:02:17 PM; Lifecycle Status: Active; Minimum Order: 1; Number of Terminations: 2; Operating Temperature: -55°C ~ 155°C; Package / Case: 0805 (2012 Metric); Packaging: TapeAndReel; PartId: 32640; Part Status: Active; Price: 0.01; Ratings: AEC-Q200; Resistance: 100 kOhms; Series: CRCW; Size / Dimension: 0.079" L x 0.049" W (2.00mm x 1.25mm); Supplier 1: DigiKey; Supplier Part Number 1: 541-100KCCT-ND; Supplier Device Package: 0805; Tolerance: ±1%
R7 = CRCW080510R0FKEAC: RES 10 OHM 1% 1/8W 0805; Manufacturer: Vishay Dale; Power (Watts): 0.125W, 1/8W; Temperature Coefficient: ±100ppm/°C; Part Number: CRCW080510R0FKEAC; Value: 10 Ohms; ComponentLink1Description: Datasheet; ComponentLink1URL: http://www.vishay.com/docs/28773/crcwce3.pdf; ComponentLink2Description: DigiKey Link; ComponentLink2URL: https://www.digikey.com/en/products/detail/vishay-dale/CRCW080510R0FKEAC/7928554; Composition: Thick Film; Device Package: 0805 (2012 Metric); Height - Seated (Max): 0.024" (0.60mm); LastUpdated: 2/8/2024 9:01:19 PM; Lifecycle Status: Active; Minimum Order: 1; Number of Terminations: 2; Operating Temperature: -55°C ~ 155°C; Package / Case: 0805 (2012 Metric); Packaging: TapeAndReel; PartId: 46232; Part Status: Active; Price: 0.01; Resistance: 10 Ohms; Series: CRCW-C; Size / Dimension: 0.079" L x 0.049" W (2.00mm x 1.25mm); Supplier 1: DigiKey; Supplier Part Number 1: 541-4132-1-ND; Supplier Device Package: 0805; Tolerance: ±1%
R8 = CRCW080511K0FKEAHP: RES SMD 11K OHM 1% 1/2W 0805; Manufacturer: Vishay Dale; Power (Watts): 0.5W, 1/2W; Resistance: 11 kOhms; Temperature Coefficient: ±100ppm/°C; Part Number: CRCW080511K0FKEAHP; Value: 13 kOhms; ComponentLink1Description: Datasheet; ComponentLink1URL: https://www.vishay.com/docs/20043/crcwhpe3.pdf; ComponentLink2Description: DigiKey Link; ComponentLink2URL: https://www.digikey.com/en/products/detail/vishay-dale/CRCW080511K0FKEAHP/2227077; Composition: Thick Film; Device Package: 0805 (2012 Metric); Features: Automotive AEC-Q200, Pulse Withstanding; Height - Seated (Max): 0.020" (0.50mm); LastUpdated: 2/8/2024 9:00:38 PM; Lifecycle Status: Active; Minimum Order: 1; Number of Terminations: 2; Operating Temperature: -55°C ~ 155°C; Package / Case: 0805 (2012 Metric); Packaging: TapeAndReel; PartId: 61644; Part Status: Active; Price: 0.02; Ratings: AEC-Q200; Series: CRCW-HP; Size / Dimension: 0.079" L x 0.049" W (2.00mm x 1.25mm); Supplier 1: DigiKey; Supplier Part Number 1: 541-CRCW080511K0FKEAHPCT-ND; Supplier Device Package: 0805; Tolerance: ±1%
R9 R11 = RT0805BRD075K1L: RES SMD 5.1K OHM 0.1% 1/8W 0805; Manufacturer: Yageo; Power (Watts): 0.125W, 1/8W; Temperature Coefficient: ±25ppm/°C; Part Number: RT0805BRD075K1L; Value: 5.1 kOhms; ComponentLink1Description: Datasheet; ComponentLink1URL: https://www.yageo.com/upload/media/product/productsearch/datasheet/rchip/PYu-RT_1-to-0.01_RoHS_L_11.pdf; ComponentLink2Description: DigiKey Link; ComponentLink2URL: https://www.digikey.com/en/products/detail/yageo/RT0805BRD075K1L/1075977; Composition: Thin Film; Device Package: 0805 (2012 Metric); Height - Seated (Max): 0.024" (0.60mm); LastUpdated: 7/25/2024 9:20:25 AM; Lifecycle Status: Active; Minimum Order: 1; Number of Terminations: 2; Operating Temperature: -55°C ~ 155°C; Package / Case: 0805 (2012 Metric); Packaging: TapeAndReel; PartId: 32968; Part Status: Active; Price: 0.04; Resistance: 5.1 kOhms; Series: RT; Size / Dimension: 0.079" L x 0.049" W (2.00mm x 1.25mm); Supplier 1: DigiKey; Supplier Part Number 1: YAG1938CT-ND; Supplier Device Package: 0805; Tolerance: ±0.1%
R10 = CRCW0805100RFKEAC: RES 100 OHM 1% 1/8W 0805; Manufacturer: Vishay Dale; Power (Watts): 0.125W, 1/8W; Temperature Coefficient: ±100ppm/°C; Part Number: CRCW0805100RFKEAC; Value: 100 Ohms; ComponentLink1Description: Datasheet; ComponentLink1URL: http://www.vishay.com/docs/28773/crcwce3.pdf; ComponentLink2Description: DigiKey Link; ComponentLink2URL: https://www.digikey.com/en/products/detail/vishay-dale/CRCW0805100RFKEAC/7928401; Composition: Thick Film; Device Package: 0805 (2012 Metric); Height - Seated (Max): 0.024" (0.60mm); LastUpdated: 2/8/2024 9:01:05 PM; Lifecycle Status: Active; Minimum Order: 1; Number of Terminations: 2; Operating Temperature: -55°C ~ 155°C; Package / Case: 0805 (2012 Metric); Packaging: TapeAndReel; PartId: 47768; Part Status: Active; Price: 0.01; Resistance: 100 Ohms; Series: CRCW-C; Size / Dimension: 0.079" L x 0.049" W (2.00mm x 1.25mm); Supplier 1: DigiKey; Supplier Part Number 1: 541-3979-1-ND; Supplier Device Package: 0805; Tolerance: ±1%
R12 R13 = RNCS0805BKE10K0: as R1 on sheet Control; Part Number: RNCS0805BKE10K0; Value: 10 k; ComponentLink1Description: Datasheet; ComponentLink1URL: https://www.seielect.com/catalog/sei-rncs_rnch.pdf; ComponentLink2Description: DigiKey Link; ComponentLink2URL: https://www.digikey.com/en/products/detail/stackpole-electronics-inc/RNCS0805BKE10K0/1800067; Composition: Thin Film; Device Package: 0805 (2012 Metric); Features: Anti-Corrosive, Automotive AEC-Q200, Moisture Resistant; Height - Seated (Max): 0.026" (0.65mm); LastUpdated: 2/8/2024 9:02:39 PM; Lifecycle Status: Active; Minimum Order: 1; Number of Terminations: 2; Operating Temperature: -55°C ~ 155°C; Package / Case: 0805 (2012 Metric); Packaging: TapeAndReel; PartId: 27713; Part Status: Active; Price: 0.07; Ratings: AEC-Q200; Series: RNCS; Size / Dimension: 0.079" L x 0.049" W (2.00mm x 1.25mm); Supplier 1: DigiKey; Supplier Part Number 1: RNCS0805BKE10K0CT-ND; Supplier Device Package: 0805; Tolerance: ±0.1%
R14 = RMCF0805FT64K9: RES 64.9K OHM 1% 1/8W 0805; Manufacturer: Stackpole Electronics Inc; Power (Watts): 0.125W, 1/8W; Temperature Coefficient: ±100ppm/°C; Part Number: RMCF0805FT64K9; Value: 64.9 kOhms; ComponentLink1Description: Datasheet; ComponentLink1URL: https://www.seielect.com/catalog/sei-packaging.pdf; ComponentLink2Description: DigiKey Link; ComponentLink2URL: https://www.digikey.com/en/products/detail/stackpole-electronics-inc/RMCF0805FT64K9/1713303; Composition: Thick Film; Device Package: 0805 (2012 Metric); Features: Automotive AEC-Q200; Height - Seated (Max): 0.026" (0.65mm); LastUpdated: 2/8/2024 9:01:11 PM; Lifecycle Status: Active; Minimum Order: 1; Number of Terminations: 2; Operating Temperature: -55°C ~ 155°C; Package / Case: 0805 (2012 Metric); Packaging: CutTape; PartId: 47058; Part Status: Active; Price: 0.01; Ratings: AEC-Q200; Resistance: 64.9 kOhms; Series: RMCF; Size / Dimension: 0.079" L x 0.049" W (2.00mm x 1.25mm); Supplier 1: DigiKey; Supplier Part Number 1: 738-RMCF0805FT64K9CT-ND; Supplier Device Package: 0805; Tolerance: ±1%
R15 = Y40221K00000T0R: RES SMD 1K OHM 0.01% 1/5W 0805; Manufacturer: Vishay Foil Resistors (Division of Vishay Precision Group); Power (Watts): 0.2W, 1/5W; Temperature Coefficient: ±0.2ppm/°C; Part Number: Y40221K00000T0R; Value: 1 kOhms; ComponentLink1Description: Datasheet; ComponentLink1URL: http://www.vishaypg.com/docs/63209/FRSM.pdf; ComponentLink2Description: DigiKey Link; ComponentLink2URL: https://www.digikey.com/en/products/detail/vishay-foil-resistors-division-of-vishay-precision-group/Y40221K00000T0R/2640995; Composition: Metal Foil; Device Package: 0805 (2012 Metric); Features: Moisture Resistant, Non-Inductive; Height - Seated (Max): 0.025" (0.64mm); LastUpdated: 2/8/2024 9:02:07 PM; Lifecycle Status: Active; Minimum Order: 1; Number of Terminations: 2; Operating Temperature: -55°C ~ 150°C; Package / Case: 0805 (2012 Metric); Packaging: TapeAndReel; PartId: 34935; Part Status: Active; Price: 12.16; Resistance: 1 kOhms; Series: FRSM; Size / Dimension: 0.080" L x 0.050" W (2.03mm x 1.27mm); Supplier 1: DigiKey; Supplier Part Number 1: Y4022-1.0KBCT-ND; Supplier Device Package: 0805; Tolerance: ±0.01%
R16 = AC0805JR-0727KL: RES SMD 27K OHM 5% 1/8W 0805; Manufacturer: Yageo; Power (Watts): 0.125W, 1/8W; Temperature Coefficient: ±100ppm/°C; Part Number: AC0805JR-0727KL; Value: 27 kOhms; ComponentLink1Description: Datasheet; ComponentLink1URL: https://www.yageo.com/upload/media/product/productsearch/datasheet/rchip/PYu-AC_51_RoHS_L_10.pdf; ComponentLink2Description: DigiKey Link; ComponentLink2URL: https://www.digikey.com/en/products/detail/yageo/AC0805JR-0727KL/5897103; Composition: Thick Film; Device Package: 0805 (2012 Metric); Features: Automotive AEC-Q200, Moisture Resistant; Height - Seated (Max): 0.024" (0.60mm); LastUpdated: 7/25/2024 9:20:06 AM; Lifecycle Status: Active; Minimum Order: 1; Number of Terminations: 2; Operating Temperature: -55°C ~ 155°C; Package / Case: 0805 (2012 Metric); Packaging: TapeAndReel; PartId: 84032; Price: 0.01; Ratings: AEC-Q200; Resistance: 27 kOhms; Series: AC; Size / Dimension: 0.079" L x 0.049" W (2.00mm x 1.25mm); Supplier 1: DigiKey; Supplier Part Number 1: 13-AC0805JR-0727KLCT-ND; Supplier Device Package: 0805; Tolerance: ±5%

## Nets that join several sheets
+2.9V: Control (20 pins), PowerDelivery (5 pins)
GND: Control (19 pins), PowerDelivery (25 pins)
I2C_SCL: Control (R19.1 U1.4), PowerDelivery (IC1.5)
I2C_SDA: Control (R18.1 U1.3), PowerDelivery (IC1.4)
I_Sense: Control (U1.9), PowerDelivery (IC3.4)
INT: Control (U1.2), PowerDelivery (IC1.9)
V_Sense: Control (U1.7), PowerDelivery (R6.1 R8.2)